# Altium schematic sheet main.SchDoc
size 209 x 297 mm; Address1: Address1; Address2: Address2; Address3: Address3; Address4: Address4; SheetNumber: 1; SheetTotal: 1; Scale: 1:1; Разраб.: Михаил Каа; Обозначение документа: ZX80BD.001 Э3; Пров.: Jeckas; Утв.: chat; Номер листа: 1; Общее количество листов: 1; Наименование организации: Михаил Каа; Перв. применение: ZX80BD.001; Наименование изделия 1: Отладочная плата; Наименование изделия 2: Схема электрическая; Наименование изделия 3: принципиальная; Нач. отд.: Нач. отд.; Фамилия нач. отд.: chat
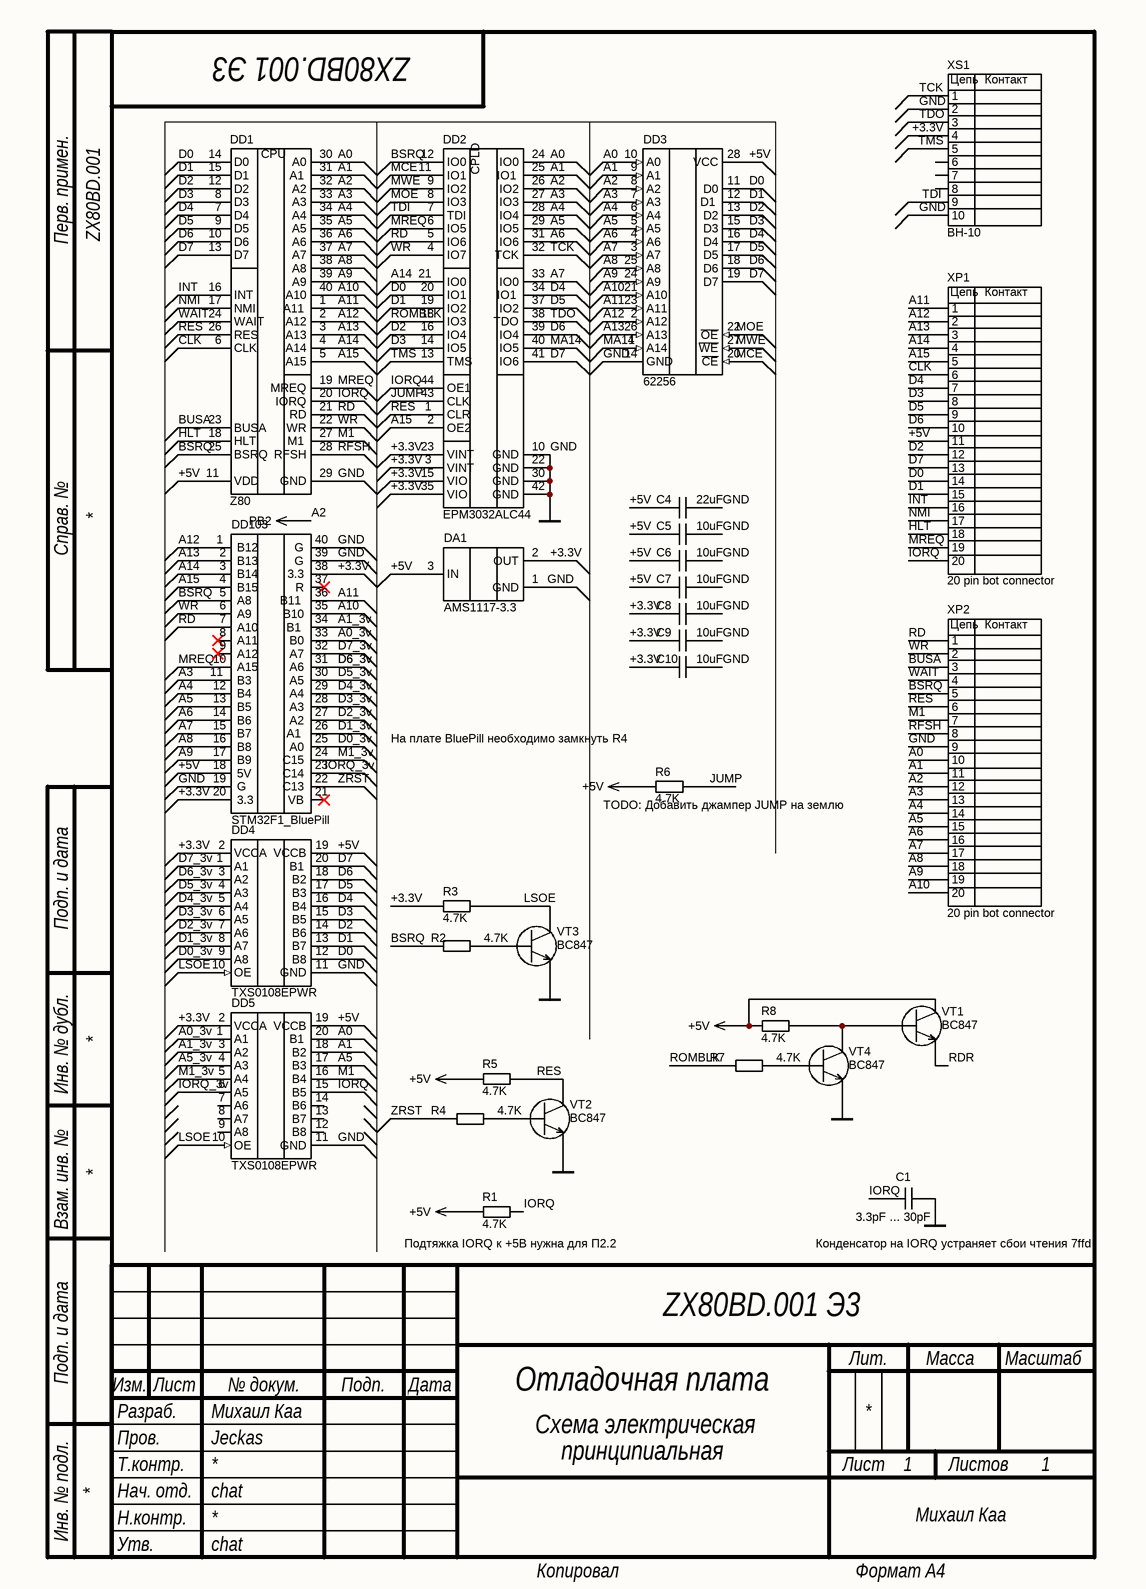
[diagram p0: main.SchDoc]

## Parts
C1  3.3pF ... 30pF  [C0805]
C4  22uF  [С1206]
C5  10uF  [C0805]
C6  10uF  [C0805]
C7  10uF  [C0805]
C8  10uF  [C0805]
C9  10uF  [C0805]
C10  10uF  [C0805]
DA1  AMS1117-3.3  [SOT229P700X180-4N]
DD1  Z80  [DIP1540W47P254L5320H635Q40B]
DD2  EPM3032ALC44  [PLCC-44-R]
DD3  62256  [DIP28]
DD4  TXS0108EPWR  [SOP65P640X120-20N]
DD5  TXS0108EPWR  [SOP65P640X120-20N]
DD103  STM32F1_BluePill  [PCB-STM32F103]
R1  4.7K  [R0805]
R2  4.7K  [R0805]
R3  4.7K  [R0805]
R4  4.7K  [R0805]
R5  4.7K  [R0805]
R6  4.7K  [R0805]
R7  4.7K  [R0805]
R8  4.7K  [R0805]
VT1  BC847  [BC847]
VT2  BC847  [BC847]
VT3  BC847  [BC847]
VT4  BC847  [BC847]
XP1  20 pin bot connector  [20pin header]
XP2  20 pin bot connector  [20pin header]
XS1  BH-10  [BH-10]

## Nets
+5V: C4.1 C5.1 C6.1 C7.1 DA1.3(IN) DD1.11(VDD) DD3.28(VCC) DD4.19(VCCB) DD5.19(VCCB) DD103.18(5V) R1.2 R5.2 R6.2 R8.2 VT1.3(C) XP1.11
A2: DD1.32(A2) DD2.26(IO2) DD3.8(A2) XP2.12  [also labelled PB2]
GND: C1.2 C4.2 C5.2 C6.2 C7.2 C8.2 C9.2 C10.2 DA1.1(GND) DD1.29(GND) DD2.10(GND) DD2.22(GND) DD2.30(GND) DD2.42(GND) DD3.14(GND) DD4.11(GND) DD5.11(GND) DD103.19(G) DD103.39(G) DD103.40(G) VT2.2(E) VT3.2(E) VT4.2(E) XP2.9 XS1.2 XS1.10
+3.3V: C8.1 C9.1 C10.1 DA1.2(OUT) DD2.3(VINT) DD2.15(VIO) DD2.23(VINT) DD2.35(VIO) DD4.2(VCCA) DD5.2(VCCA) DD103.20(3.3) DD103.38(3.3) R3.2 XS1.4
A0: DD1.30(A0) DD2.24(IO0) DD3.10(A0) DD5.20(B1) XP2.10
A0_3v: DD5.1(A1) DD103.33(B0)
A1: DD1.31(A1) DD2.25(IO1) DD3.9(A1) DD5.18(B2) XP2.11
A1_3v: DD5.3(A2) DD103.34(B1)
A3: DD1.33(A3) DD2.27(IO3) DD3.7(A3) DD103.11(B3) XP2.13
A4: DD1.34(A4) DD2.28(IO4) DD3.6(A4) DD103.12(B4) XP2.14
A5: DD1.35(A5) DD2.29(IO5) DD3.5(A5) DD5.17(B3) DD103.13(B5) XP2.15
A5_3v: DD5.4(A3)
A6: DD1.36(A6) DD2.31(IO6) DD3.4(A6) DD103.14(B6) XP2.16
A7: DD1.37(A7) DD2.33(IO0) DD3.3(A7) DD103.15(B7) XP2.17
A8: DD1.38(A8) DD3.25(A8) DD103.16(B8) XP2.18
A9: DD1.39(A9) DD3.24(A9) DD103.17(B9) XP2.19
A10: DD1.40(A10) DD3.21(A10) DD103.35(B10) XP2.20
A11: DD1.1(A11) DD3.23(A11) DD103.36(B11) XP1.1
A12: DD1.2(A12) DD3.2(A12) DD103.1(B12) XP1.2
A13: DD1.3(A13) DD3.26(A13) DD103.2(B13) XP1.3
A14: DD1.4(A14) DD2.21(IO0) DD103.3(B14) XP1.4
A15: DD1.5(A15) DD2.2(OE2) DD103.4(B15) XP1.5
BSRQ: DD1.25(BSRQ) DD2.12(IO0) DD103.5(A8) R2.1 XP2.5
BUSA: DD1.23(BUSA) XP2.3
CLK: DD1.6(CLK) XP1.6
D0: DD1.14(D0) DD2.20(IO1) DD3.11(D0) DD4.12(B8) XP1.14
D0_3v: DD4.9(A8) DD103.25(A0)
D1: DD1.15(D1) DD2.19(IO2) DD3.12(D1) DD4.13(B7) XP1.15
D1_3v: DD4.8(A7) DD103.26(A1)
D2: DD1.12(D2) DD2.16(IO4) DD3.13(D2) DD4.14(B6) XP1.12
D2_3v: DD4.7(A6) DD103.27(A2)
D3: DD1.8(D3) DD2.14(IO5) DD3.15(D3) DD4.15(B5) XP1.8
D3_3v: DD4.6(A5) DD103.28(A3)
D4: DD1.7(D4) DD2.34(IO1) DD3.16(D4) DD4.16(B4) XP1.7
D4_3v: DD4.5(A4) DD103.29(A4)
D5: DD1.9(D5) DD2.37(IO2) DD3.17(D5) DD4.17(B3) XP1.9
D5_3v: DD4.4(A3) DD103.30(A5)
D6: DD1.10(D6) DD2.39(IO4) DD3.18(D6) DD4.18(B2) XP1.10
D6_3v: DD4.3(A2) DD103.31(A6)
D7: DD1.13(D7) DD2.41(IO6) DD3.19(D7) DD4.20(B1) XP1.13
D7_3v: DD4.1(A1) DD103.32(A7)
HLT: DD1.18(HLT) XP1.18
INT: DD1.16(INT) XP1.16
IORQ: C1.1 DD1.20(IORQ) DD2.44(OE1) DD5.15(B5) R1.1 XP1.20
IORQ_3v: DD5.6(A5) DD103.23(C14)
JUMP: DD2.43(CLK) R6.1
LSOE: DD4.10(OE) DD5.10(OE) R3.1 VT3.3(C)
M1: DD1.27(M1) DD5.16(B4) XP2.7
M1_3v: DD5.5(A4) DD103.24(C15)
MA14: DD2.40(IO5) DD3.1(A14)
MCE: DD2.11(IO1) DD3.20(~{CE})
MOE: DD2.8(IO3) DD3.22(~{OE})
MREQ: DD1.19(MREQ) DD2.6(IO5) DD103.10(A15) XP1.19
MWE: DD2.9(IO2) DD3.27(~{WE})
NMI: DD1.17(NMI) XP1.17
RD: DD1.21(RD) DD2.5(IO6) DD103.7(A10) XP2.1
RDR: VT1.2(E)
RES: DD1.26(RES) DD2.1(CLR) R5.1 VT2.3(C) XP2.6
RFSH: DD1.28(RFSH) XP2.8
ROMBLK: DD2.18(IO3) R7.1
TCK: DD2.32(TCK) XS1.1
TDI: DD2.7(TDI) XS1.9
TDO: DD2.38(TDO) XS1.3
TMS: DD2.13(TMS) XS1.5
WAIT: DD1.24(WAIT) XP2.4
WR: DD1.22(WR) DD2.4(IO7) DD103.6(A9) XP2.2
ZRST: DD103.22(C13) R4.1
NetR2_2: R2.2 VT3.1(B)
NetR4_2: R4.2 VT2.1(B)
NetR7_2: R7.2 VT4.1(B)
NetR8_1: R8.1 VT1.1(B) VT4.3(C)

Not connected (* = marked no-connect by the designer): DD5 7(A6) 8(A7) 9(A8) 12(B8) 13(B7) 14(B6); DD103 8(A11)* 9(A12)* 21(VB)* 37(R)*; XS1 6 7 8

## Notes on the sheet
- (near R6) На плате BluePill необходимо замкнуть R4
- (near R6) TODO: Добавить джампер JUMP на землю
- (near R1) Подтяжка IORQ к +5В нужна для П2.2
- (near C1) Конденсатор на IORQ устраняет сбои чтения 7ffd
- Перв. примен.
- Справ. №
- Подп. и дата
- Инв. № дубл.
- Взам. инв. №
- Разраб.
- Изм.
- Лист
- № докум.
- Подп.
- Дата
- Лит.
- Масса
- Масштаб
- Пров.
- Т.контр.
- Листов
- Инв. № подл.
- Утв.
- Н.контр.
- Копировал
- Формат А4
- (in symbol 20 pin bot connector) Цепь; Контакт
- (in symbol BH-10) Цепь; Контакт
- (in symbol EPM3032ALC44) CPLD
- (in symbol Z80) CPU

## Library data of the parts
C1 C4-C10 = CapCer
DD2 = EPM3032ALC44: 44-Pin PLCC44
DD3 = 62256: MF: BRADY; SnapEDA_Link: https://www.snapeda.com/parts/62256/Brady/view-part/?ref=snap; Package: None; Value: *; MP: 62256; Check_prices: https://www.snapeda.com/parts/62256/Brady/view-part/?ref=eda
DD4 DD5 = TXS0108EPWR: 8-bit bidirectional voltage-level shifter for open-drain and push-pull application; MF: Texas Instruments; Value: *; SnapEDA_Link: https://www.snapeda.com/parts/TXS0108EPWR/Texas+Instruments/view-part/?ref=snap; Purchase-URL: https://pricing.snapeda.com/search/part/TXS0108EPWR/?ref=eda; Availability: In Stock; Price: None; Package: TSSOP-20 Texas Instruments; Check_prices: https://www.snapeda.com/parts/TXS0108EPWR/Texas+Instruments/view-part/?ref=eda; MP: TXS0108EPWR
DD103 = STM32F1_BluePill: STM32F103C8T6; Ед. изм.: шт; Value: BluePill; Марка и технические характеристики: BluePill; Наименование материалов или оборудования: BluePill
R1-R8 = Res
VT1-VT4 = BC847: NPN Transistor
XP1 XP2 = 20 pin bot connector: 20 Pin 2.54 mm
XS1 = BH-10: 10 Position Total Dual Row 2.54 mm Pitch Straight Male Shrouded Box Header; MF: Sullins Connector; MP: SBH11-PBPC-D05-ST-BK; SnapEDA_Link: https://www.snapeda.com/parts/SBH11-PBPC-D05-ST-BK/Sullins+Connector+Solutions/view-part/?ref=snap; Package: None; Value: *; Check_prices: https://www.snapeda.com/parts/SBH11-PBPC-D05-ST-BK/Sullins+Connector+Solutions/view-part/?ref=eda